# EAGLE design axiom_beta_plugin_module_1xUSB30 (EAGLE 7.7.0)
Assembly variants: Beta
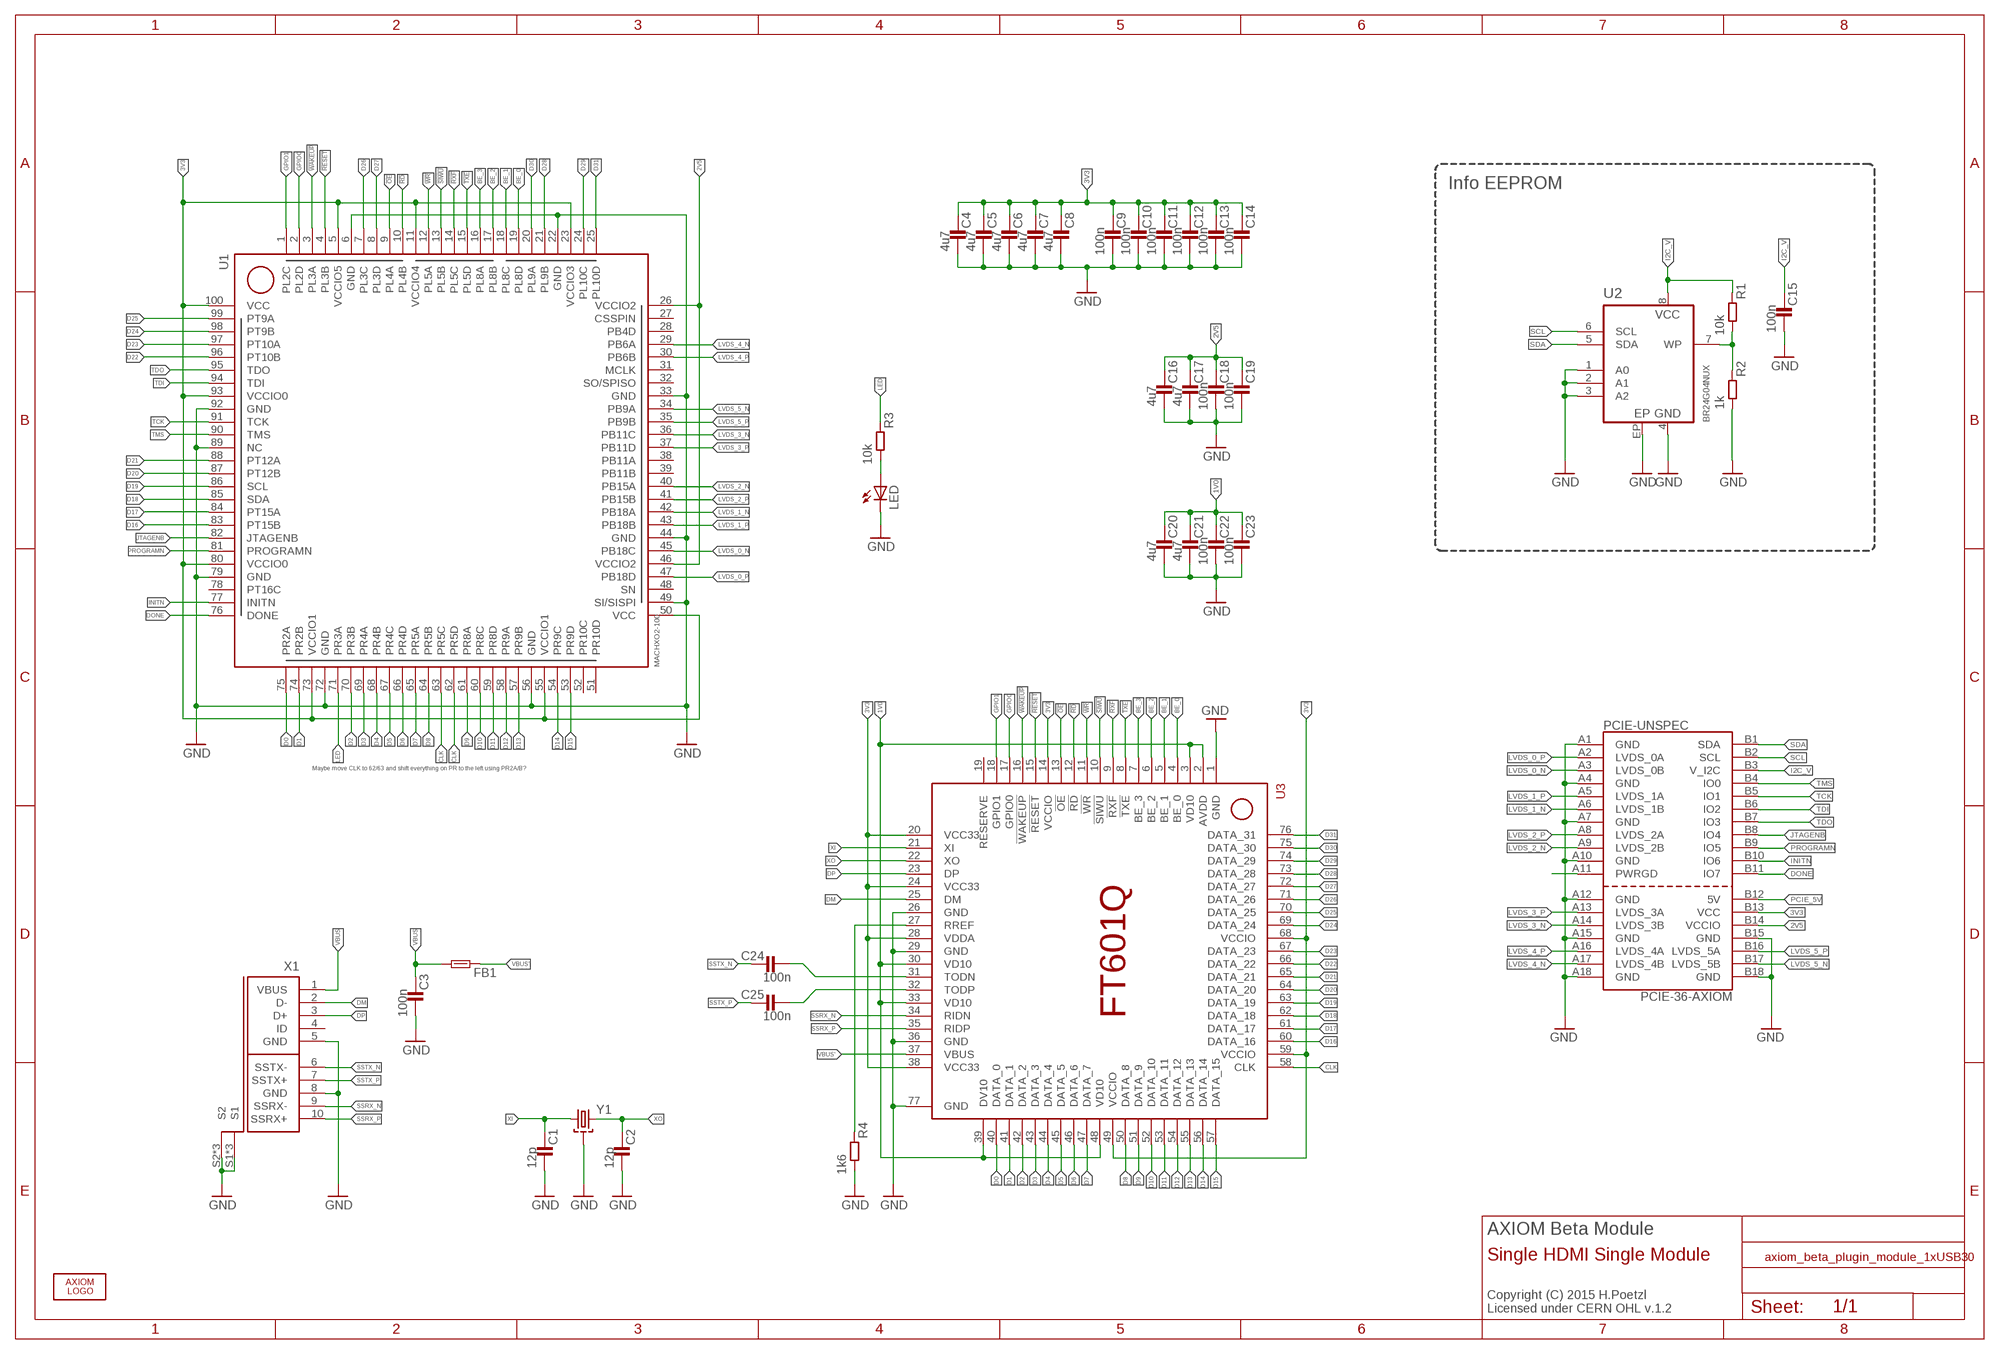
[diagram p0: schematic, sheet 1]

## Parts
C1  12p  C0402-C  [0402-C]
C2  12p  C0402-C  [0402-C]
C3  100n  C0402-C  [0402-C]
C4  4u7  C0402-C  [0402-C]
C5  4u7  C0402-C  [0402-C]
C6  4u7  C0402-C  [0402-C]
C7  4u7  C0402-C  [0402-C]
C8  4u7  C0402-C  [0402-C]
C9  100n  C0402-C  [0402-C]
C10  100n  C0402-C  [0402-C]
C11  100n  C0402-C  [0402-C]
C12  100n  C0402-C  [0402-C]
C13  100n  C0402-C  [0402-C]
C14  100n  C0402-C  [0402-C]
C15  100n  C0402-C  [0402-C]
C16  4u7  C0402-C  [0402-C]
C17  4u7  C0402-C  [0402-C]
C18  100n  C0402-C  [0402-C]
C19  100n  C0402-C  [0402-C]
C20  4u7  C0402-C  [0402-C]
C21  4u7  C0402-C  [0402-C]
C22  100n  C0402-C  [0402-C]
C23  100n  C0402-C  [0402-C]
C24  100n  C0201-C  [0201-C]
C25  100n  C0201-C  [0201-C]
FB1  FB0402-C  [0402-C]
LED  LED  [CHIPLED_0603]
PCIE-UNSPEC  PCIE-36-AXIOM  [PCIE-36-AXIOM]  (not fitted in variant Beta)
R1  10k  R0402-C  [0402-C]
R2  1k  R0402-C  [0402-C]
R3  10k  R0402-B  [0402-B]
R4  1k6  R0201-C  [0201-C]
U1  MACHXO2-100  [MACHXO2-100TQFP]
U2  BR24G04NUX  [DFN200X300X100-9N]
U3  FT601QQFN76  [QFN76]
U$  AXIOM_LOGO328X50  [AXIOM_LOGO_328X50]
X1  10_USB_3.0_2S-SMT  [MICRO-B-30-H-SMT]
Y1  SMD-4P-2G-2.0X1.6  [2.0X1.6]

## Nets
1V0 [power]: C20.1 C21.1 C22.1 C23.1 U3.2(AVDD) U3.3(VD10) U3.30(VD10) U3.33(VD10) U3.39(DV10) U3.48(VD10)
2V5 [power]: C16.1 C17.1 C18.1 C19.1 PCIE-UNSPEC.B14(VCCIO) U1.26(VCCIO2) U1.46(VCCIO2)
3V3 [power]: C4.1 C5.1 C6.1 C7.1 C8.1 C9.1 C10.1 C11.1 C12.1 C13.1 C14.1 PCIE-UNSPEC.B13(VCC) U1.5(VCCIO5) U1.11(VCCIO4) U1.23(VCCIO3) U1.50(VCC) U1.55(VCCIO1) U1.73(VCCIO1) U1.80(VCCIO0) U1.93(VCCIO0) U1.100(VCC) U3.14(VCCIO) U3.20(VCC33) U3.24(VCC33) U3.28(VDDA) U3.38(VCC33) U3.49(VCCIO) U3.59(VCCIO) U3.68(VCCIO)
!OE [parallel]: U1.9(PL4A) U3.13(!OE)
!RD [parallel]: U1.10(PL4B) U3.12(!RD)
!RESET: U1.4(PL3B) U3.15(!RESET)
!RXF [parallel]: U1.14(PL5C) U3.9(!RXF)
!SIWU [parallel]: U1.13(PL5B) U3.10(!SIWU)
!TXE [parallel]: U1.15(PL5D) U3.8(!TXE)
!WAKEUP: U1.3(PL3A) U3.16(!WAKEUP)
!WR [parallel]: U1.12(PL5A) U3.11(!WR)
BE_0 [parallel]: U1.19(PL8D) U3.4(BE_0)
BE_1 [parallel]: U1.18(PL8C) U3.5(BE_1)
BE_2 [parallel]: U1.17(PL8B) U3.6(BE_2)
BE_3 [parallel]: U1.16(PL8A) U3.7(BE_3)
CLK [parallel]: U1.62(PR5D) U1.63(PR5C) U3.58(CLK)
D0 [parallel]: U1.75(PR2A) U3.40(DATA_0)
D1 [parallel]: U1.74(PR2B) U3.41(DATA_1)
D2 [parallel]: U1.70(PR3B) U3.42(DATA_2)
D3 [parallel]: U1.69(PR4A) U3.43(DATA_3)
D4 [parallel]: U1.68(PR4B) U3.44(DATA_4)
D5 [parallel]: U1.67(PR4C) U3.45(DATA_5)
D6 [parallel]: U1.66(PR4D) U3.46(DATA_6)
D7 [parallel]: U1.65(PR5A) U3.47(DATA_7)
D8 [parallel]: U1.64(PR5B) U3.50(DATA_8)
D9 [parallel]: U1.61(PR8A) U3.51(DATA_9)
D10 [parallel]: U1.60(PR8C) U3.52(DATA_10)
D11 [parallel]: U1.59(PR8D) U3.53(DATA_11)
D12 [parallel]: U1.58(PR9A) U3.54(DATA_12)
D13 [parallel]: U1.57(PR9B) U3.55(DATA_13)
D14 [parallel]: U1.54(PR9C) U3.56(DATA_14)
D15 [parallel]: U1.53(PR9D) U3.57(DATA_15)
D16 [parallel]: U1.83(PT15B) U3.60(DATA_16)
D17 [parallel]: U1.84(PT15A) U3.61(DATA_17)
D18 [parallel]: U1.85(SDA) U3.62(DATA_18)
D19 [parallel]: U1.86(SCL) U3.63(DATA_19)
D20 [parallel]: U1.87(PT12B) U3.64(DATA_20)
D21 [parallel]: U1.88(PT12A) U3.65(DATA_21)
D22 [parallel]: U1.96(PT10B) U3.66(DATA_22)
D23 [parallel]: U1.97(PT10A) U3.67(DATA_23)
D24 [parallel]: U1.98(PT9B) U3.69(DATA_24)
D25 [parallel]: U1.99(PT9A) U3.70(DATA_25)
D26 [parallel]: U1.7(PL3C) U3.71(DATA_26)
D27 [parallel]: U1.8(PL3D) U3.72(DATA_27)
D28 [parallel]: U1.21(PL9B) U3.73(DATA_28)
D29 [parallel]: U1.24(PL10C) U3.74(DATA_29)
D30 [parallel]: U1.20(PL9A) U3.75(DATA_30)
D31 [parallel]: U1.25(PL10D) U3.76(DATA_31)
DM: U3.25(DM) X1.2(D-)
DONE: PCIE-UNSPEC.B11(IO7) U1.76(DONE)
DP: U3.23(DP) X1.3(D+)
GND: C1.2 C2.2 C3.2 C4.2 C5.2 C6.2 C7.2 C8.2 C9.2 C10.2 C11.2 C12.2 C13.2 C14.2 C15.2 C16.2 C17.2 C18.2 C19.2 C20.2 C21.2 C22.2 C23.2 LED.C PCIE-UNSPEC.A1(GND) PCIE-UNSPEC.A4(GND) PCIE-UNSPEC.A7(GND) PCIE-UNSPEC.A10(GND) PCIE-UNSPEC.A12(GND) PCIE-UNSPEC.A15(GND) PCIE-UNSPEC.A18(GND) PCIE-UNSPEC.B15(GND) PCIE-UNSPEC.B18(GND) R2.2 R4.2 U1.6(GND) U1.22(GND) U1.33(GND) U1.44(GND) U1.49(SI/SISPI) U1.56(GND) U1.72(GND) U1.79(GND) U1.89(NC) U1.92(GND) U2.1(A0) U2.2(A1) U2.3(A2) U2.4(GND) U2.EP U3.1(GND) U3.26(GND) U3.29(GND) U3.36(GND) U3.77(GND) X1.5(GND) X1.8(GND) X1.S1 X1.S2 X1.Z1(S1) X1.Z2(S1) X1.Z3(S2) X1.Z4(S2) Y1.2(GND) Y1.4(GND)
GPIO0: U1.2(PL2D) U3.17(GPIO0)
GPIO1: U1.1(PL2C) U3.18(GPIO1)
I2C_V: C15.1 PCIE-UNSPEC.B3(V_I2C) R1.1 U2.8(VCC)
INITN: PCIE-UNSPEC.B10(IO6) U1.77(INITN)
JTAGENB: PCIE-UNSPEC.B8(IO4) U1.82(JTAGENB)
LED: R3.1 U1.71(PR3A)
LVDS_0_N [LVDS]: PCIE-UNSPEC.A3(LVDS_0B) U1.45(PB18C)
LVDS_0_P [LVDS]: PCIE-UNSPEC.A2(LVDS_0A) U1.47(PB18D)
LVDS_1_N [LVDS]: PCIE-UNSPEC.A6(LVDS_1B) U1.42(PB18A)
LVDS_1_P [LVDS]: PCIE-UNSPEC.A5(LVDS_1A) U1.43(PB18B)
LVDS_2_N [LVDS]: PCIE-UNSPEC.A9(LVDS_2B) U1.40(PB15A)
LVDS_2_P [LVDS]: PCIE-UNSPEC.A8(LVDS_2A) U1.41(PB15B)
LVDS_3_N [LVDS]: PCIE-UNSPEC.A14(LVDS_3B) U1.36(PB11C)
LVDS_3_P [LVDS]: PCIE-UNSPEC.A13(LVDS_3A) U1.37(PB11D)
LVDS_4_N [LVDS]: PCIE-UNSPEC.A17(LVDS_4B) U1.29(PB6A)
LVDS_4_P [LVDS]: PCIE-UNSPEC.A16(LVDS_4A) U1.30(PB6B)
LVDS_5_N [LVDS]: PCIE-UNSPEC.B17(LVDS_5B) U1.34(PB9A)
LVDS_5_P [LVDS]: PCIE-UNSPEC.B16(LVDS_5A) U1.35(PB9B)
N$1: LED.A R3.2
N$2: R4.1 U3.27(RREF)
N$12: R1.2 R2.1 U2.7(WP)
N$209: PCIE-UNSPEC.A11(PWRGD)
PCIE_5V: PCIE-UNSPEC.B12(5V)
PROGRAMN: PCIE-UNSPEC.B9(IO5) U1.81(PROGRAMN)
SCL: PCIE-UNSPEC.B2(SCL) U2.6(SCL)
SDA: PCIE-UNSPEC.B1(SDA) U2.5(SDA)
SSRX_N [MGT]: U3.34(RIDN) X1.9(SSRX-)
SSRX_P [MGT]: U3.35(RIDP) X1.10(SSRX+)
SSTX_N [MGT]: C24.1 X1.6(SSTX-)
SSTX_P [MGT]: C25.1 X1.7(SSTX+)
TCK: PCIE-UNSPEC.B5(IO1) U1.91(TCK)
TDI: PCIE-UNSPEC.B6(IO2) U1.94(TDI)
TDO: PCIE-UNSPEC.B7(IO3) U1.95(TDO)
TMS: PCIE-UNSPEC.B4(IO0) U1.90(TMS)
TOD_N [MGT]: C24.2 U3.31(TODN)
TOD_P [MGT]: C25.2 U3.32(TODP)
VBUS [power]: C3.1 FB1.2 X1.1(VBUS)
VBUS' [power]: FB1.1 U3.37(VBUS)
XI: C1.1 U3.21(XI) Y1.1
XO: C2.1 U3.22(XO) Y1.3
Unconnected: U1.27(CSSPIN) U1.28(PB4D) U1.31(MCLK) U1.32(SO/SPISO) U1.38(PB11A) U1.39(PB11B) U1.48(SN) U1.51(PR10D) U1.52(PR10C) U1.78(PT16C) U3.19(RESERVE) X1.4(ID)

## Notes on the sheet
- Info EEPROM
- Maybe move CLK to 62/63 and shift everything on PR to the left using PR2A/B?
- AXIOM Beta Module
- Single HDMI Single Module
- Copyright (C) 2015 H.Poetzl
  Licensed under CERN OHL v.1.2

## Library data of the parts
C1-C25 = generic-rcl:C
FB1 = generic-rcl:FB
LED = led:LED
PCIE-UNSPEC = PCIe:PCIE-36-AXIOM
R1-R4 = generic-rcl:R
U1 = machxo2:MACHXO2-100: Lattice MachXO2 ultra low power, instant-on, non-volatile PLD.
U2 = eeprom:BR24G04
U3 = ft601q:FT601Q
U$ = logos_apertus_axiom:AXIOM_LOGO
X1 = usb:10_USB_3.0_2S
Y1 = xtal:SMD-4P-2G

## Net classes
0 default: width 0.127 mm, drill 0.203 mm, clearance 0.127 mm
1 power: width 0.203 mm, drill 0.254 mm, clearance 0.152 mm
2 LVDS: width 0.152 mm, drill 0.203 mm, clearance 0.152 mm
3 MGT: width 0.127 mm, drill 0.203 mm, clearance 0.127 mm
4 parallel: width 0.127 mm, drill 0.203 mm, clearance 0.127 mm

## Board
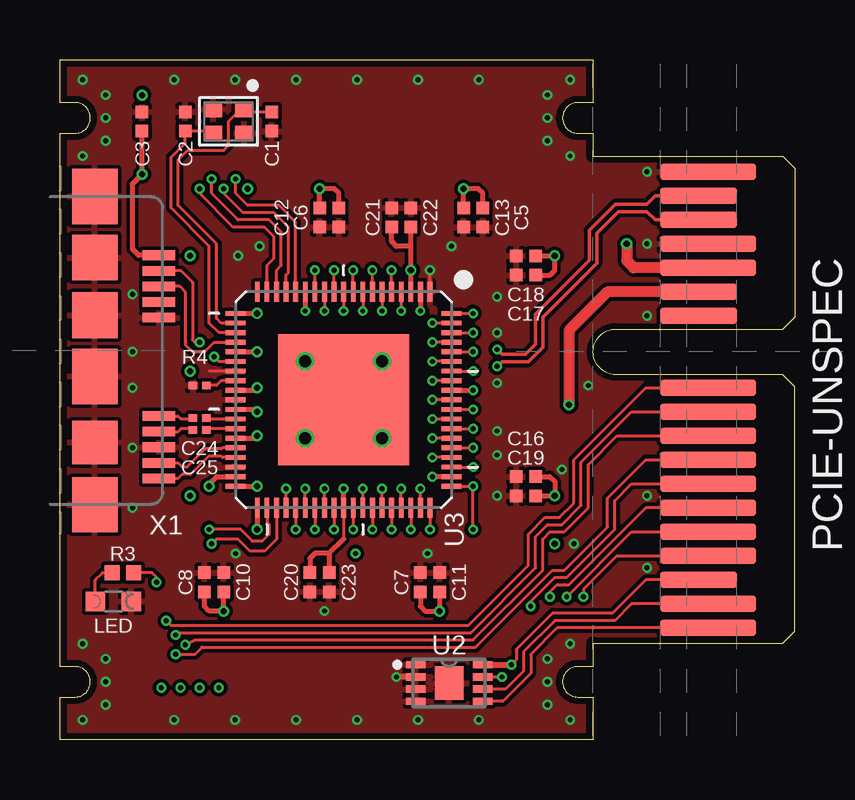
[diagram p1: board, top side]
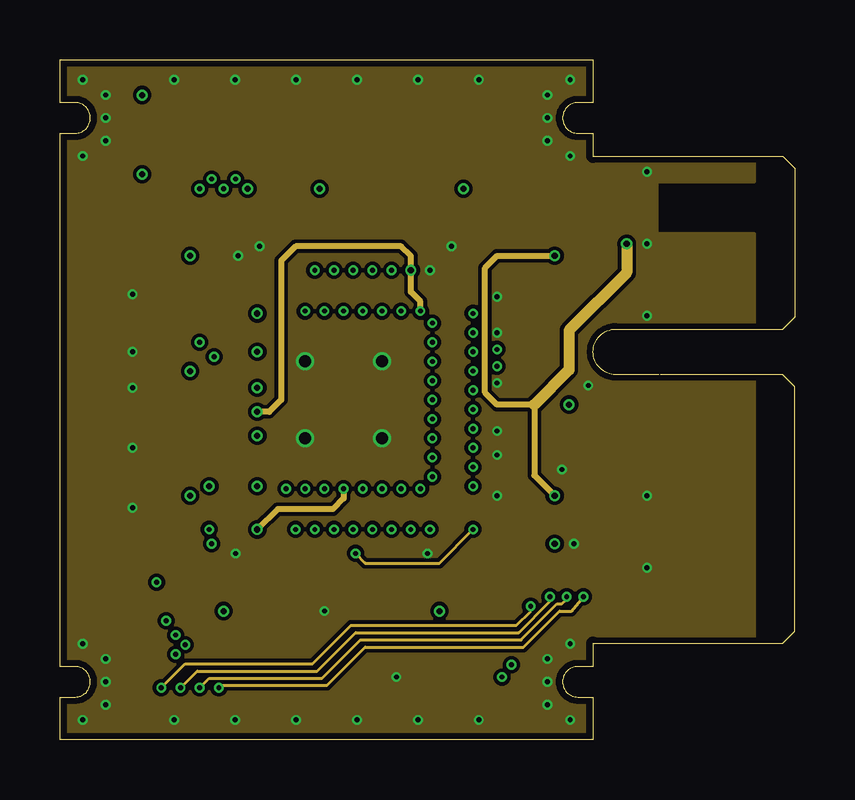
[diagram p2: board, inner layer Route2]
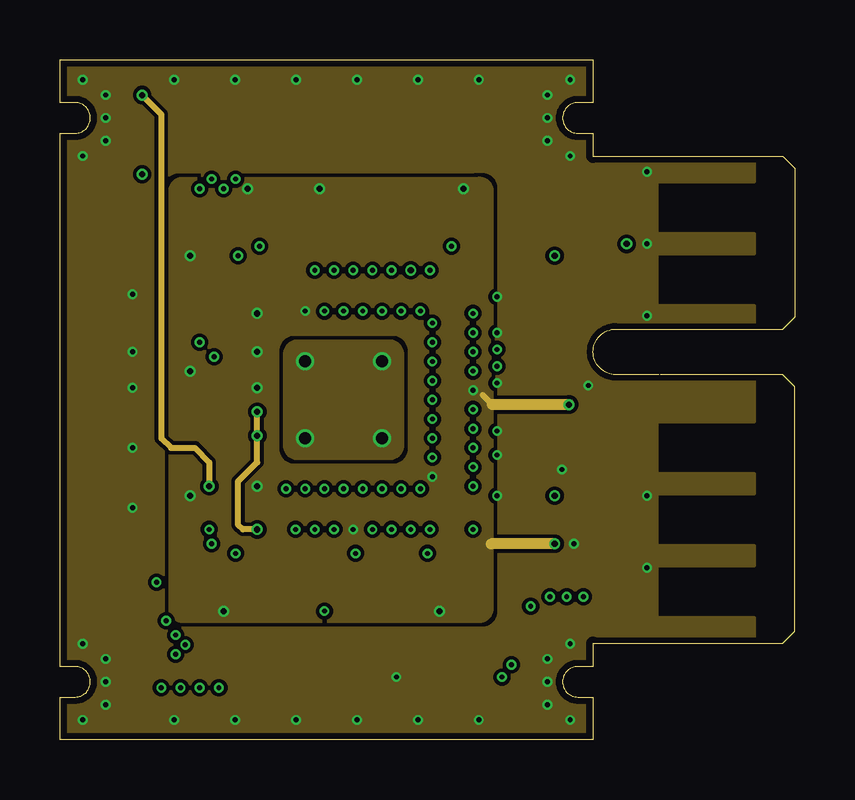
[diagram p3: board, inner layer Route15]
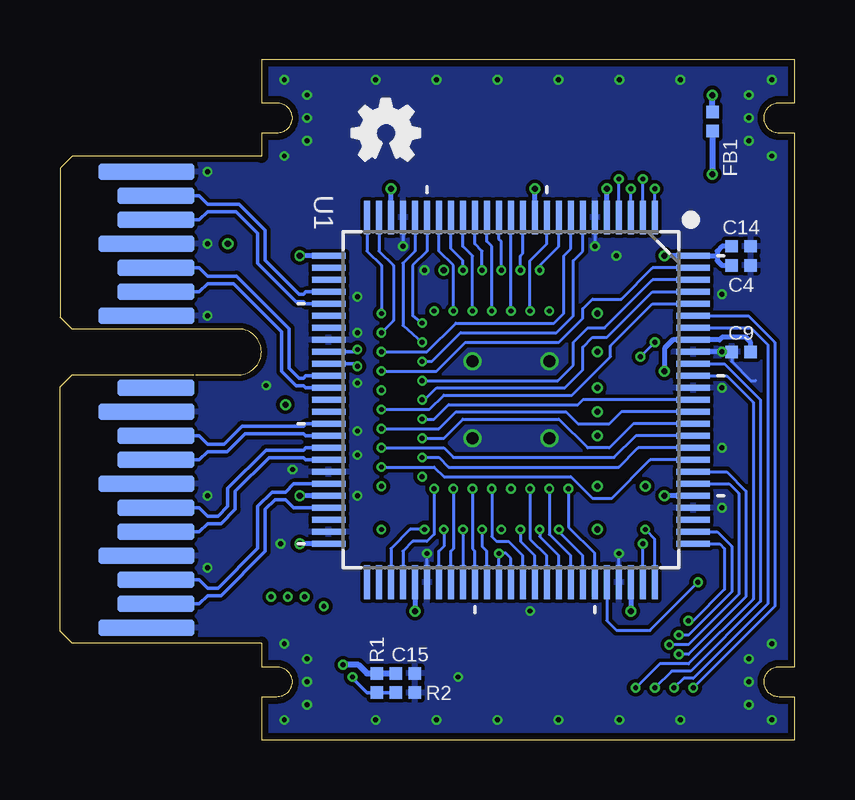
[diagram p4: board, bottom side, seen from below]

Size 30.62 x 28.32 mm. Coordinates in mm from the lower left corner, seen from the top.
Outline: 22.23,24.31 22.23,25.27 21.59,25.27 arc-90 20.96,25.91 arc-90 21.59,26.54 22.23,26.54 22.23,28.32 0,28.32 0,26.54 0.64,26.54 arc-90 1.27,25.91 arc-90 0.64,25.27 0,25.27 0,3.05 0.64,3.05 arc-90 1.27,2.41 arc-90 0.64,1.78 0,1.78 0,0 22.23,0 22.23,1.78 21.59,1.78 arc-90 20.96,2.41 arc-90 21.59,3.05 22.23,3.05 22.23,4.01
Copper layers (1*2*15*16): Top 0.035559375mm / dielectric 0.17018125mm / Route2 0.01778125mm / dielectric 47mil / Route15 0.01778125mm / dielectric 0.17018125mm / Bottom 0.035559375mm
Design rules "OSHPark-4layer-tuned *": minimum track width 5mil, minimum drill 8mil, track to track 6mil, track to pad 5mil, pad to pad 5mil, via to via 5mil, smd to smd 5mil, copper to edge 10mil, drill to drill 6mil, minimum pad ring 4mil, minimum via ring 4mil, stop-mask expansion 2mil, vias tented up to drill 20mil, thermal gap 6mil
tKeepout: area -1,24.3 to 2.2,27.5; area -1,0.8 to 2.2,4; area 20,0.8 to 23.2,4; area 20,24.3 to 23.2,27.5
bKeepout: area -1,24.3 to 2.2,27.5; area -1,0.8 to 2.2,4; area 20,0.8 to 23.2,4; area 20,24.3 to 23.2,27.5
tRestrict: area 7.4,18.2 to 7.8,18.6; area 7.4,9.8 to 7.8,10.2; area 15.8,9.8 to 16.2,10.2; area 15.8,18.2 to 16.2,18.6; area 7.8,15.2 to 8,15.6; area 7.8,14 to 8,14.4; area 7.8,11.2 to 8,11.6

### Footprints (pad centres in the part's own frame; a part is rotated, then mirrored left to right if it is on the bottom)
0402-C = smd 0.52 x 0.52: 1 -0.4,0; 2 0.4,0
0201-C = smd 0.36 x 0.32: 1 -0.28,0; 2 0.28,0
CHIPLED_0603 = smd 0.8 x 0.8: A 0,-0.75; C 0,0.75
PCIE-36-AXIOM = smd 0.7 x 4 bottom: A1 -11.5,3.6; A4 -8.5,3.6; A7 -5.5,3.6; A10 -2.5,3.6; A12 1.5,3.6; A15 4.5,3.6; A18 7.5,3.6 | smd 0.7 x 3.2 bottom: A2 -10.5,4; A3 -9.5,4; A5 -7.5,4; A6 -6.5,4; A8 -4.5,4; A9 -3.5,4; A11 -1.5,4; A13 2.5,4; A14 3.5,4; A16 5.5,4; A17 6.5,4 | smd 0.7 x 4: B1 -11.5,3.6; B2 -10.5,3.6; B4 -8.5,3.6; B5 -7.5,3.6; B6 -6.5,3.6; B7 -5.5,3.6; B8 -4.5,3.6; B9 -3.5,3.6; B10 -2.5,3.6; B11 -1.5,3.6; B14 3.5,3.6; B15 4.5,3.6; B18 7.5,3.6 | smd 0.7 x 3.2: B3 -9.5,4; B12 1.5,4; B13 2.5,4; B16 5.5,4; B17 6.5,4
0402-B = smd 0.62 x 0.62: 1 -0.45,0; 2 0.45,0
MACHXO2-100TQFP = smd 1.4 x 0.25: 1 -7.6,6; 2 -7.6,5.5; 3 -7.6,5; 4 -7.6,4.5; 5 -7.6,4; 6 -7.6,3.5; 7 -7.6,3; 8 -7.6,2.5; 9 -7.6,2; 10 -7.6,1.5; 11 -7.6,1; 12 -7.6,0.5; 13 -7.6,0; 14 -7.6,-0.5; 15 -7.6,-1; 16 -7.6,-1.5; 17 -7.6,-2; 18 -7.6,-2.5; 19 -7.6,-3; 20 -7.6,-3.5; 21 -7.6,-4; 22 -7.6,-4.5; 23 -7.6,-5; 24 -7.6,-5.5; 25 -7.6,-6; 51 7.6,-6; 52 7.6,-5.5; 53 7.6,-5; 54 7.6,-4.5; 55 7.6,-4; 56 7.6,-3.5; 57 7.6,-3; 58 7.6,-2.5; 59 7.6,-2; 60 7.6,-1.5; 61 7.6,-1; 62 7.6,-0.5; 63 7.6,0; 64 7.6,0.5; 65 7.6,1; 66 7.6,1.5; 67 7.6,2; 68 7.6,2.5; 69 7.6,3; 70 7.6,3.5; 71 7.6,4; 72 7.6,4.5; 73 7.6,5; 74 7.6,5.5; 75 7.6,6 | smd 0.25 x 1.4: 26 -6,-7.6; 27 -5.5,-7.6; 28 -5,-7.6; 29 -4.5,-7.6; 30 -4,-7.6; 31 -3.5,-7.6; 32 -3,-7.6; 33 -2.5,-7.6; 34 -2,-7.6; 35 -1.5,-7.6; 36 -1,-7.6; 37 -0.5,-7.6; 38 0,-7.6; 39 0.5,-7.6; 40 1,-7.6; 41 1.5,-7.6; 42 2,-7.6; 43 2.5,-7.6; 44 3,-7.6; 45 3.5,-7.6; 46 4,-7.6; 47 4.5,-7.6; 48 5,-7.6; 49 5.5,-7.6; 50 6,-7.6; 76 6,7.6; 77 5.5,7.6; 78 5,7.6; 79 4.5,7.6; 80 4,7.6; 81 3.5,7.6; 82 3,7.6; 83 2.5,7.6; 84 2,7.6; 85 1.5,7.6; 86 1,7.6; 87 0.5,7.6; 88 0,7.6; 89 -0.5,7.6; 90 -1,7.6; 91 -1.5,7.6; 92 -2,7.6; 93 -2.5,7.6; 94 -3,7.6; 95 -3.5,7.6; 96 -4,7.6; 97 -4.5,7.6; 98 -5,7.6; 99 -5.5,7.6; 100 -6,7.6
DFN200X300X100-9N = smd 0.813 x 0.305: 1 -1.397,0.762; 2 -1.397,0.254; 3 -1.397,-0.254; 4 -1.397,-0.762; 5 1.397,-0.762; 6 1.397,-0.254; 7 1.397,0.254; 8 1.397,0.762 | smd 1.194 x 1.397: EP 0,0
QFN76 = smd 0.84 x 0.2: 1 -4.5,3.6; 2 -4.5,3.2; 3 -4.5,2.8; 4 -4.5,2.4; 5 -4.5,2; 6 -4.5,1.6; 7 -4.5,1.2; 8 -4.5,0.8; 9 -4.5,0.4; 10 -4.5,0; 11 -4.5,-0.4; 12 -4.5,-0.8; 13 -4.5,-1.2; 14 -4.5,-1.6; 15 -4.5,-2; 16 -4.5,-2.4; 17 -4.5,-2.8; 18 -4.5,-3.2; 19 -4.5,-3.6; 39 4.5,-3.6; 40 4.5,-3.2; 41 4.5,-2.8; 42 4.5,-2.4; 43 4.5,-2; 44 4.5,-1.6; 45 4.5,-1.2; 46 4.5,-0.8; 47 4.5,-0.4; 48 4.5,0; 49 4.5,0.4; 50 4.5,0.8; 51 4.5,1.2; 52 4.5,1.6; 53 4.5,2; 54 4.5,2.4; 55 4.5,2.8; 56 4.5,3.2; 57 4.5,3.6 | smd 0.2 x 0.84: 20 -3.6,-4.5; 21 -3.2,-4.5; 22 -2.8,-4.5; 23 -2.4,-4.5; 24 -2,-4.5; 25 -1.6,-4.5; 26 -1.2,-4.5; 27 -0.8,-4.5; 28 -0.4,-4.5; 29 0,-4.5; 30 0.4,-4.5; 31 0.8,-4.5; 32 1.2,-4.5; 33 1.6,-4.5; 34 2,-4.5; 35 2.4,-4.5; 36 2.8,-4.5; 37 3.2,-4.5; 38 3.6,-4.5; 58 3.6,4.5; 59 3.2,4.5; 60 2.8,4.5; 61 2.4,4.5; 62 2,4.5; 63 1.6,4.5; 64 1.2,4.5; 65 0.8,4.5; 66 0.4,4.5; 67 0,4.5; 68 -0.4,4.5; 69 -0.8,4.5; 70 -1.2,4.5; 71 -1.6,4.5; 72 -2,4.5; 73 -2.4,4.5; 74 -2.8,4.5; 75 -3.2,4.5; 76 -3.6,4.5 | smd 5.45 x 5.45: 77 0,0
MICRO-B-30-H-SMT = smd 0.4 x 1.35: 1 -1.3,4.125; 2 -0.65,4.125; 3 0,4.125; 4 0.65,4.125; 5 1.3,4.125; 6 5.4,4.125; 7 6.05,4.125; 8 6.7,4.125; 9 7.35,4.125; 10 8,4.125 | smd 2.3 x 1.9: S1 -3.75,1.45; S2 9.1,1.45; Z3 3.75,1.45 | smd 1.9 x 1.9: Z1 -1.2,1.45; Z2 1.2,1.45 | smd 1.8 x 1.9: Z4 6.5,1.45
2.0X1.6 = smd 0.75 x 0.65: 1 -0.65,-0.5; 2 0.65,-0.5; 3 0.65,0.5; 4 -0.65,0.5

### Placement (x,y rotation side)
C1  8.83,25.76 270 top
C2  5.23,25.76 90 top
C3  3.43,25.76 90 top
C4  2.23,19.76 0 bottom
C5  17.62,21.76 270 top
C6  11.63,21.76 270 top
C7  15.03,6.56 90 top
C8  6.03,6.56 90 top
C9  2.23,16.16 180 bottom
C10  6.83,6.56 90 top
C11  15.83,6.56 90 top
C12  10.83,21.76 270 top
C13  16.83,21.76 270 top
C14  2.23,20.56 0 bottom
C15  16.23,2.76 0 bottom
C16  19.43,10.96 180 top
C17  19.43,19.36 180 top
C18  19.43,20.16 180 top
C19  19.43,10.16 180 top
C20  10.43,6.56 270 top
C21  13.83,21.76 90 top
C22  14.63,21.76 90 top
C23  11.23,6.56 270 top
C24  5.83,13.41 0 top
C25  5.83,12.91 0 top
FB1  3.43,25.76 270 bottom
LED  2.23,5.76 270 top
LOGO2  OSHW_LOGO_FILLX0100-NT  [OSHW_FILLX100_NOTEXT]  18.45,24.15 0 bottom
PCIE-UNSPEC  30.62,16.16 90 top
R1  17.43,2.36 270 bottom
R2  16.23,1.96 0 bottom
R3  2.62,6.96 180 top
R4  5.83,14.76 180 top
U1  11.83,14.16 270 bottom
U2  16.23,2.36 0 top
U3  11.83,14.16 270 top
U$  10.42,25.33 0 top
X1  0,18.89 270 top
Y1  7.03,25.76 180 top

### Tracks (layer width: path | path; a pad name or v marks a point on that pad's centre or on a via)
1V0  (via drill 0.2, 0.25)
  Top 0.127: U3.48 11.83,8.36
  Top 0.203: U3.2 v15.03,17.86 | U3.33 8.13,12.56 v8.23,12.66 | U3.30 8.13,13.76 v8.23,13.66 | U3.48 v11.83,10.46 | U3.39 v8.23,8.76 | 11.83,8.36 11.23,7.76 | U3.3 v14.63,19.56 14.63,20.56 | 11.23,7.76 10.63,7.76 10.43,7.56 C20.1 | 14.63,20.56 14.03,20.56 13.83,20.76 C21.1 | 11.23,7.76 C23.1 | 14.63,20.56 C22.1
  Route2 0.254: v15.03,17.86 15.03,18.26 U3.3 v14.63,19.56 14.63,20.16 14.23,20.56 9.83,20.56 9.23,19.96 9.23,14.16 8.73,13.66 v8.23,13.66 | v11.83,10.46 11.83,10.06 11.38,9.61 9.08,9.61 v8.23,8.76
  Route15 0.254: v8.23,13.66 v8.23,12.66 8.23,11.56 7.43,10.76 7.43,8.96 7.63,8.76 v8.23,8.76
2V5  (via drill 0.25, 0.26)
  Top 0.203: C19.1 v20.62,10.16 20.62,10.76 20.43,10.96 C16.1 | C18.1 v20.62,20.16 20.62,19.56 20.43,19.36 C17.1
  Top 0.457: PCIE-UNSPEC.B14 23.93,19.66 23.62,19.96 v23.62,20.66
  Route2 0.256: v20.62,20.16 18.23,20.16 17.73,19.66 17.73,14.46 18.23,13.96 19.78,13.96 19.78,11.01 v20.62,10.16
  Route2 0.457: v23.62,20.66 23.62,19.46 21.23,17.06 21.23,15.41 19.78,13.96
  Bottom 0.203: U1.26 v20.62,20.16 | U1.46 v20.62,10.16
3V3  (via drill 0.2, 0.25, 0.26)
  Top 0.127: U3.49 v12.23,8.76
  Top 0.203: C10.1 v6.83,5.36 6.23,5.36 6.03,5.56 C8.1 | C11.1 v15.83,5.36 15.23,5.36 15.03,5.56 C7.1 | C12.1 v10.83,22.96 11.43,22.96 11.63,22.76 C6.1 | C13.1 v16.83,22.96 17.43,22.96 17.62,22.76 C5.1 | U3.28 8.13,14.56 v8.23,14.66 | U3.38 v8.23,10.56 | U3.24 v8.23,16.16 | U3.20 v8.23,17.76 | U3.14 v10.23,17.86 | U3.59 v15.53,10.96 | U3.68 v17.23,14.56
  Top 0.457: PCIE-UNSPEC.B13 22.83,18.66 21.23,17.06 v21.23,13.96
  Route15 0.254: 18.03,13.96 17.62,14.36
  Route15 0.457: v21.23,13.96 18.03,13.96 | v20.62,8.16 17.98,8.16
  Bottom 0.203: U1.73 v6.83,5.36 | U1.55 v15.83,5.36 | U1.5 v7.83,22.96 | U1.11 v10.83,22.96 | U1.23 v16.83,22.96 | C9.1 1.83,16.56 2.03,16.76 3.03,16.76 3.12,16.66 U1.93 5.08,16.66 5.43,16.31 v5.43,15.36 | U1.80 v5.43,10.16 | U1.50 v20.62,8.16 | v5.43,20.16 U1.100 3.23,20.16 | C14.1 3.03,20.56 3.23,20.36 3.23,20.16 | 3.23,20.16 3.23,19.96 3.03,19.76 C4.1
  pour Route15 (rank 2): 4.62,5.47 4.62,22.85 arc-90 5.13,23.36 17.47,23.36 arc-90 17.98,22.85 17.98,5.47 arc-90 17.47,4.96 5.13,4.96 arc-90
!OE  (via drill 0.2)
  Top 0.127: U3.13 v10.63,19.56
  Bottom 0.127: v10.63,19.56 10.63,19.76 9.83,20.56 U1.9
!RD  (via drill 0.2)
  Top 0.127: U3.12 v11.03,17.86
  Bottom 0.127: v11.03,17.86 11.03,19.96 10.33,20.66 U1.10
!RESET  (via drill 0.2)
  Top 0.127: U3.15 9.83,21.56 9.13,22.26 7.83,22.26 7.33,22.76 v7.33,23.36
  Bottom 0.127: U1.4 v7.33,23.36
!RXF  (via drill 0.2)
  Top 0.127: U3.9 v12.23,19.56
  Bottom 0.127: v12.23,19.56 12.23,20.76 12.33,20.86 U1.14
!SIWU  (via drill 0.2)
  Top 0.127: U3.10 v11.83,17.86
  Bottom 0.127: v11.83,17.86 U1.13
!TXE  (via drill 0.2)
  Top 0.127: U3.8 v12.63,17.86
  Bottom 0.127: v12.63,17.86 12.63,20.56 12.83,20.76 U1.15
!WAKEUP  (via drill 0.2)
  Top 0.127: U3.16 9.43,19.36 9.53,19.46 9.53,21.36 8.93,21.96 7.63,21.96 6.83,22.76 v6.83,22.96
  Bottom 0.127: U1.3 v6.83,22.96
!WR  (via drill 0.2)
  Top 0.127: U3.11 v11.43,19.56
  Bottom 0.127: v11.43,19.56 11.43,20.16 11.33,20.26 U1.12
BE_0  (via drill 0.2)
  Top 0.127: U3.4 v14.23,17.86
  Bottom 0.127: v14.23,17.86 14.23,19.76 14.83,20.36 U1.19
BE_1  (via drill 0.2)
  Top 0.127: U3.5 v13.83,19.56
  Bottom 0.127: v13.83,19.56 13.83,19.96 14.33,20.46 U1.18
BE_2  (via drill 0.2)
  Top 0.127: U3.6 v13.43,17.86
  Bottom 0.127: v13.43,17.86 13.43,20.16 13.83,20.56 U1.17
BE_3  (via drill 0.2)
  Top 0.127: U3.7 v13.03,19.56
  Bottom 0.127: v13.03,19.56 13.03,20.36 13.33,20.66 U1.16
CLK  (via drill 0.2)
  Top 0.127: U3.58 v17.23,10.56 v17.23,8.76
  Route2 0.127: v12.33,7.76 12.73,7.36 15.83,7.36 v17.23,8.76
  Bottom 0.127: U1.63 11.83,7.56 12.03,7.76 v12.33,7.76 U1.62
D0  (via drill 0.2)
  Top 0.127: U3.40 8.63,9.06 8.73,8.96 8.73,8.56 8.43,8.26 8.03,8.26 7.53,8.76 v6.23,8.76
  Bottom 0.127: v6.23,8.76 5.83,8.36 U1.75
D1  (via drill 0.2)
  Top 0.127: U3.41 9.03,8.36 8.53,7.86 7.93,7.86 7.43,8.36 6.53,8.36 v6.33,8.16
  Bottom 0.127: U1.74 v6.33,8.16
D2  (via drill 0.2)
  Top 0.127: U3.42 v9.43,10.46
  Bottom 0.127: v9.43,10.46 9.43,8.86 8.33,7.76 U1.70
D3  (via drill 0.2)
  Top 0.127: U3.43 v9.83,8.76
  Bottom 0.127: v9.83,8.76 9.83,8.66 8.83,7.66 U1.69
D4  (via drill 0.2)
  Top 0.127: U3.44 v10.23,10.46
  Bottom 0.127: v10.23,10.46 10.23,8.56 9.33,7.66 U1.68
D5  (via drill 0.2)
  Top 0.127: U3.45 v10.63,8.76
  Bottom 0.127: v10.63,8.76 10.63,8.46 9.83,7.66 U1.67
D6  (via drill 0.2)
  Top 0.127: U3.46 v11.03,10.46
  Bottom 0.127: v11.03,10.46 11.03,8.36 10.33,7.66 U1.66
D7  (via drill 0.2)
  Top 0.127: U3.47 v11.43,8.76
  Bottom 0.127: v11.43,8.76 11.43,8.26 10.83,7.66 U1.65
D8  (via drill 0.2)
  Top 0.127: U3.50 v12.63,10.46
  Bottom 0.127: v12.63,10.46 12.63,8.46 12.43,8.26 11.93,8.26 11.33,7.66 U1.64
D9  (via drill 0.2)
  Top 0.127: U3.51 v13.03,8.76
  Bottom 0.127: v13.03,8.76 13.03,8.06 12.83,7.86 U1.61
D10  (via drill 0.2)
  Top 0.127: U3.52 v13.43,10.46
  Bottom 0.127: v13.43,10.46 13.43,7.96 13.33,7.86 U1.60
D11  (via drill 0.2)
  Top 0.127: U3.53 v13.83,8.76
  Bottom 0.127: v13.83,8.76 U1.59
D12  (via drill 0.2)
  Top 0.127: U3.54 v14.23,10.46
  Bottom 0.127: v14.23,10.46 14.23,7.96 14.33,7.86 U1.58
D13  (via drill 0.2)
  Top 0.127: U3.55 v14.63,8.76
  Bottom 0.127: v14.63,8.76 14.63,8.06 14.83,7.86 U1.57
D14  (via drill 0.2)
  Top 0.127: U3.56 v15.03,10.46
  Bottom 0.127: v15.03,10.46 15.03,8.56 15.33,8.26 15.93,8.26 16.33,7.86 U1.54
D15  (via drill 0.2)
  Top 0.127: U3.57 v15.43,8.76
  Bottom 0.127: v15.43,8.76 16.03,8.76 16.83,7.96 U1.53
D16  (via drill 0.2)
  Top 0.127: U3.60 v17.23,11.36
  Bottom 0.127: v17.23,11.36 15.03,11.36 14.63,10.96 9.33,10.96 8.43,10.06 7.63,10.06 6.03,11.66 U1.83
D17  (via drill 0.2)
  Top 0.127: U3.61 v15.53,11.76
  Bottom 0.127: v15.53,11.76 14.83,11.76 14.43,11.36 7.33,11.36 6.53,12.16 U1.84
D18  (via drill 0.2)
  Top 0.127: U3.62 v17.23,12.16
  Bottom 0.127: v17.23,12.16 14.63,12.16 14.23,11.76 7.53,11.76 6.63,12.66 U1.85
D19  (via drill 0.2)
  Top 0.127: U3.63 v15.53,12.56
  Bottom 0.127: v15.53,12.56 14.63,12.56 13.83,13.36 9.83,13.36 8.63,12.16 7.73,12.16 6.73,13.16 U1.86
D20  (via drill 0.2)
  Top 0.127: U3.64 v17.23,12.96
  Bottom 0.127: v17.23,12.96 14.83,12.96 14.13,13.66 9.53,13.66 9.03,13.16 7.73,13.16 7.23,13.66 U1.87
D21  (via drill 0.2)
  Top 0.127: U3.65 v15.53,13.36
  Bottom 0.127: v15.53,13.36 15.03,13.36 14.43,13.96 9.03,13.96 8.83,14.16 U1.88
D22  (via drill 0.2)
  Top 0.127: U3.66 v17.23,13.76
  Bottom 0.127: v17.23,13.76 15.23,13.76 14.63,14.36 9.28,14.36 7.68,15.96 7.68,16.41 5.93,18.16 U1.96
D23  (via drill 0.2)
  Top 0.127: U3.67 v15.53,14.16
  Bottom 0.127: v15.53,14.16 15.43,14.16 14.93,14.66 9.58,14.66 8.83,15.41 8.83,16.36 8.43,16.76 7.83,16.76 5.93,18.66 U1.97
D24  (via drill 0.2)
  Top 0.127: U3.69 v15.53,14.96
  Bottom 0.127: v15.53,14.96 9.88,14.96 9.23,15.61 9.23,16.56 8.63,17.16 7.93,17.16 5.93,19.16 U1.98
D25  (via drill 0.2)
  Top 0.127: U3.70 v17.23,15.36
  Bottom 0.127: v17.23,15.36 14.93,15.36 13.73,16.56 9.83,16.56 8.83,17.56 8.83,17.96 8.43,18.36 7.23,18.36 5.93,19.66 U1.99
D26  (via drill 0.2)
  Top 0.127: U3.71 v15.53,15.76
  Bottom 0.127: v15.53,15.76 15.13,15.76 13.93,16.96 9.93,16.96 9.23,17.66 9.23,19.96 8.83,20.36 U1.7
D27  (via drill 0.2)
  Top 0.127: U3.72 v17.23,16.16
  Bottom 0.127: v17.23,16.16 15.33,16.16 14.13,17.36 10.03,17.36 9.63,17.76 9.63,20.16 9.33,20.46 U1.8
D28  (via drill 0.2)
  Top 0.127: U3.73 v15.53,16.56
  Bottom 0.127: U1.21 15.83,20.36 16.33,19.86 16.33,17.26 v15.53,16.56
D29  (via drill 0.2)
  Top 0.127: U3.74 v17.23,16.96
  Bottom 0.127: U1.24 17.33,20.36 16.73,19.76 16.73,17.46 v17.23,16.96
D30  (via drill 0.2)
  Top 0.127: U3.75 v15.53,17.36
  Bottom 0.127: U1.20 15.33,20.36 15.93,19.76 15.93,17.66 v15.53,17.36
D31  (via drill 0.2)
  Top 0.127: U3.76 v17.23,17.76
  Bottom 0.127: U1.25 17.83,20.36 17.23,19.76 v17.23,17.76
DM  (via drill 0.2)
  Top 0.127: v5.83,16.56 5.62,16.56 5.53,16.66 5.53,19.06 5.05,19.54 X1.2 | v6.43,15.96 6.63,15.76 U3.25
  Bottom 0.127: v5.83,16.56 v6.43,15.96
DONE  (via drill 0.2)
  Top 0.127: v4.43,4.96 4.62,4.76 17.03,4.76 19.53,7.26 19.53,8.56 20.23,9.26 20.83,9.26 21.43,9.86 21.43,11.66 24.43,14.66 PCIE-UNSPEC.B11
  Bottom 0.127: v4.43,4.96 4.23,4.96 2.93,6.26 2.93,7.96 3.12,8.16 U1.76
DP
  Top 0.127: U3.23 6.43,16.56 6.03,16.16 5.53,16.16 5.23,16.46 5.23,18.66 5,18.89 X1.3
GND  (via drill 0.2, 0.5)
  Top 0.127: U3.1 v15.43,19.56 | v13.43,12.56 U3.77 | U3.26 6.23,15.36
  Top 0.254: U2.2 v14.03,2.61
  Bottom 0.127: U1.72 v7.33,7.76 | U1.56 v15.33,7.76 | U1.6 v8.33,20.56 | U1.22 v16.33,20.56 | C9.2 2.62,15.76 1.83,14.96 1.62,14.96
  Bottom 0.203: C9.2 v3.03,16.16 U1.92
  other vias: 0.95,27.5 21.27,27.5 21.27,0.83 0.95,0.83 4.76,27.5 17.46,27.5 4.76,0.83 0.95,4 0.95,24.32 1.91,24.96 21.27,24.32 17.46,0.83 21.27,4 7.3,27.5 9.84,27.5 12.38,27.5 1.91,26.86 20.32,24.96 20.32,26.86 1.91,1.46 1.91,3.37 20.32,3.37 20.32,1.46 9.84,0.83 12.38,0.83 7.3,0.83 14.92,0.83 20.32,25.91 1.91,25.91 1.91,2.41 20.32,2.41 24.48,10.16 24.48,7.16 24.48,23.66 24.48,20.66 14.92,27.5 10.23,15.76 13.43,15.76 10.23,12.56 3.03,14.66 18.23,16.96 18.23,14.86 18.23,12.86 18.23,11.86 18.23,18.46 18.23,10.16 22.03,14.76 24.48,17.66 11.03,5.36 7.43,20.16 3.03,9.66 3.03,18.56 3.03,12.16 21.43,8.16 20.93,11.26
  pour Bottom (isolate 0.127): 0,28.45 22.23,28.45 22.23,24.32 25.4,24.32 25.4,3.75 22.23,3.75 22.23,-0.13 0,-0.13
  pour Top (isolate 0.127): 0,28.45 22.23,28.45 22.23,24.32 25.4,24.32 25.4,3.75 22.23,3.75 22.23,-0.13 0,-0.13
  pour Route2 (isolate 0.127, rank 3): 0,28.45 22.23,28.45 22.23,24.57 28.96,24.57 28.96,23.24 24.89,23.24 24.89,21.08 28.96,21.08 28.96,3.75 22.23,3.75 22.23,-0.13 0,-0.13
  pour Route15 (isolate 0.127, rank 3): 0,28.45 22.23,28.45 22.23,24.57 28.96,24.57 28.96,23.24 24.89,23.24 24.89,21.08 28.96,21.08 28.96,20.24 24.89,20.24 24.89,18.08 28.96,18.08 28.96,13.24 24.89,13.24 24.89,11.08 28.96,11.08 28.96,10.24 24.89,10.24 24.89,8.08 28.96,8.08 28.96,7.24 24.89,7.24 24.89,5.08 28.96,5.08 28.96,3.75 22.23,3.75 22.23,-0.13 0,-0.13
  pour Route15: 13.72,11.76 9.93,11.76 arc-90 9.43,12.27 9.43,16.05 arc-90 9.93,16.56 13.72,16.56 arc-90 14.23,16.05 14.23,12.27 arc-90
GPIO0  (via drill 0.2)
  Top 0.127: U3.17 9.03,19.56 9.23,19.76 9.23,21.16 8.73,21.66 7.43,21.66 6.33,22.76 v6.33,23.36
  Bottom 0.127: U1.2 v6.33,23.36
GPIO1  (via drill 0.2)
  Top 0.127: U3.18 8.63,19.76 8.93,20.06 8.93,20.96 8.53,21.36 7.23,21.36 5.83,22.76 v5.83,22.96
  Bottom 0.127: U1.1 v5.83,22.96
I2C_V  (via drill 0.2)
  Top 0.127: PCIE-UNSPEC.B3 24.43,6.66 23.03,5.26 20.53,5.26 19.03,3.76 19.03,3.32 v18.83,3.12
  Top 0.254: U2.8 v18.83,3.12
  Bottom 0.254: v18.83,3.12 18.19,3.12 17.83,2.76 R1.1 C15.1
INITN  (via drill 0.2)
  Top 0.127: v4.83,4.36 4.93,4.46 17.12,4.46 19.83,7.16 19.83,8.46 20.33,8.96 20.93,8.96 21.73,9.76 21.73,11.56 23.83,13.66 PCIE-UNSPEC.B10
  Bottom 0.127: v4.83,4.36 4.43,4.36 2.62,6.16 2.62,8.06 3.23,8.66 U1.77
JTAGENB  (via drill 0.2)
  Top 0.127: v4.83,3.56 5.62,3.56 5.93,3.86 17.33,3.86 20.53,7.06 21.03,7.06 22.83,8.86 22.83,10.06 24.43,11.66 PCIE-UNSPEC.B8
  Bottom 0.127: U1.82 2.83,11.16 2.03,10.36 2.03,5.96 4.43,3.56 v4.83,3.56
LED  (via drill 0.2)
  Top 0.127: v4.03,6.56 4.03,6.76 3.83,6.96 R3.1
  Bottom 0.127: U1.71 7.83,4.96 7.43,4.56 6.03,4.56 v4.03,6.56
LVDS_0_N
  Bottom 0.152: U1.45 20.88,10.66 21.23,10.31 21.79,10.31 22.38,9.72 22.38,7.97 24.04,6.31 24.48,6.31 24.82,6.66 PCIE-UNSPEC.A3
LVDS_0_P
  Bottom 0.152: U1.47 20.88,9.66 21.23,10.01 21.66,10.01 22.07,9.6 22.07,7.85 23.91,6.01 24.48,6.01 24.82,5.66 PCIE-UNSPEC.A2
LVDS_1_N
  Bottom 0.152: U1.42 20.38,12.16 20.48,12.06 22.04,12.06 23.63,10.47 23.63,9.72 24.04,9.31 24.48,9.31 24.82,9.66 PCIE-UNSPEC.A6
LVDS_1_P
  Bottom 0.152: U1.43 20.38,11.66 20.48,11.76 21.91,11.76 23.32,10.35 23.32,9.6 23.91,9.01 24.48,9.01 24.82,8.66 PCIE-UNSPEC.A5
LVDS_2_N
  Bottom 0.152: U1.40 20.38,13.16 20.48,13.06 23.04,13.06 23.79,12.31 24.48,12.31 24.82,12.66 PCIE-UNSPEC.A9
LVDS_2_P
  Bottom 0.152: U1.41 20.38,12.66 20.48,12.76 22.91,12.76 23.66,12.01 24.48,12.01 24.82,11.66 PCIE-UNSPEC.A8
LVDS_3_N
  Bottom 0.152: PCIE-UNSPEC.A14 24.82,19.66 24.48,19.31 23.26,19.31 21.07,17.12 21.07,15.47 20.66,15.06 20.48,15.06 20.38,15.16 U1.36
LVDS_3_P
  Bottom 0.152: PCIE-UNSPEC.A13 24.82,18.66 24.48,19.01 23.39,19.01 21.38,17 21.38,15.35 20.79,14.76 20.48,14.76 20.38,14.66 U1.37
LVDS_4_N
  Bottom 0.152: PCIE-UNSPEC.A17 24.82,22.66 24.48,22.31 23.16,22.31 22.07,21.22 22.07,19.97 20.66,18.56 20.48,18.56 20.38,18.66 U1.29
LVDS_4_P
  Bottom 0.152: PCIE-UNSPEC.A16 24.82,21.66 24.48,22.01 23.29,22.01 22.38,21.1 22.38,19.85 20.79,18.26 20.48,18.26 20.38,18.16 U1.30
LVDS_5_N  (via drill 0.2)
  Top 0.152: PCIE-UNSPEC.B17 24.82,22.66 24.48,22.31 23.16,22.31 22.07,21.22 22.07,19.97 19.82,17.72 19.82,16.47 19.41,16.06 18.42,16.06 v18.23,16.26
  Bottom 0.152: U1.34 18.33,16.16 v18.23,16.26
LVDS_5_P  (via drill 0.2)
  Top 0.152: PCIE-UNSPEC.B16 24.82,21.66 24.48,22.01 23.29,22.01 22.38,21.1 22.38,19.85 20.13,17.6 20.13,16.35 19.54,15.76 18.42,15.76 v18.23,15.56
  Bottom 0.152: U1.35 18.33,15.66 v18.23,15.56
N$1
  Top 0.127: LED.A 1.48,6.66 1.78,6.96 R3.2
N$2
  Top 0.127: U3.27 6.73,14.96 6.53,14.76 R4.1
N$12  (via drill 0.2)
  Top 0.152: U2.7 v18.43,2.61
  Bottom 0.152: R2.1 R1.2 17.83,1.96 18.43,2.56 v18.43,2.61
PROGRAMN  (via drill 0.2)
  Top 0.127: v5.23,3.96 5.62,4.16 17.23,4.16 20.12,7.06 20.12,8.36 20.43,8.66 21.03,8.66 22.03,9.66 22.03,11.46 23.23,12.66 PCIE-UNSPEC.B9
  Bottom 0.127: U1.81 2.73,10.66 2.33,10.26 2.33,6.06 4.43,3.96 v5.23,3.96
SCL
  Top 0.127: PCIE-UNSPEC.B2 23.83,5.66 23.12,4.96 20.62,4.96 19.33,3.66 19.33,2.86 18.57,2.11 U2.6
SDA
  Top 0.127: PCIE-UNSPEC.B1 20.73,4.66 19.62,3.56 19.62,2.76 18.46,1.6 U2.5
  Top 0.152: 17.74,1.69 U2.5 17.74,1.69
SSRX_N
  Top 0.127: U3.34 6.77,12.16 6.73,12.11 6.06,12.11 5.31,11.36 5.1,11.36 4.93,11.54 X1.9
SSRX_P
  Top 0.127: U3.35 6.77,11.76 6.73,11.81 6.19,11.81 5.44,11.06 5.1,11.06 4.93,10.89 X1.10
SSTX_N
  Top 0.127: C24.1 5.5,13.36 5.05,13.36 4.93,13.49 X1.6
SSTX_P
  Top 0.127: C25.1 5.5,12.96 5.05,12.96 4.93,12.84 X1.7
TCK  (via drill 0.2)
  Top 0.127: v21.12,5.96 23.83,8.66 PCIE-UNSPEC.B5
  Route2 0.127: v5.83,2.16 6.23,2.56 10.93,2.56 12.53,4.16 19.23,4.16 20.73,5.66 20.93,5.66 21.12,5.86 v21.12,5.96
  Bottom 0.127: U1.91 2.93,15.66 1.43,14.16 1.43,5.76 4.33,2.86 5.12,2.86 v5.83,2.16
TDI  (via drill 0.2)
  Top 0.127: PCIE-UNSPEC.B6 24.43,9.66 21.23,6.46 21.03,6.46 20.73,6.46 20.43,6.16 v20.43,5.96
  Route2 0.127: v5.03,2.16 5.73,2.86 10.73,2.86 12.33,4.46 19.12,4.46 20.43,5.76 v20.43,5.96
  Bottom 0.127: U1.94 1.83,17.16 1.12,16.46 1.12,5.66 4.23,2.56 4.62,2.56 v5.03,2.16
TDO  (via drill 0.2)
  Top 0.127: v19.62,5.56 19.62,5.76 20.62,6.76 21.12,6.76 23.12,8.76 23.12,9.96 23.83,10.66 PCIE-UNSPEC.B7
  Route2 0.127: v4.23,2.16 5.23,3.16 10.53,3.16 12.13,4.76 19.03,4.76 19.62,5.36 v19.62,5.56
  Bottom 0.127: U1.95 1.93,17.66 0.83,16.56 0.83,5.56 v4.23,2.16
TMS  (via drill 0.2)
  Top 0.127: PCIE-UNSPEC.B4 23.23,7.66 21.83,6.26 v21.83,5.96
  Route2 0.127: v6.63,2.16 6.73,2.26 11.13,2.26 12.73,3.86 19.33,3.86 20.83,5.36 21.33,5.36 v21.83,5.96
  Bottom 0.127: U1.90 2.83,15.16 1.73,14.06 1.73,5.86 4.43,3.16 5.62,3.16 v6.63,2.16
TOD_N
  Top 0.127: U3.31 6.16,13.36 C24.2
TOD_P
  Top 0.127: U3.32 6.16,12.96 C25.2
VBUS  (via drill 0.25)
  Top 0.203: X1.1 3.28,20.19 3.03,20.44 3.03,23.16 v3.43,23.56 FB1.2
  Bottom 0.254: FB1.2 v3.43,23.56
VBUS'  (via drill 0.25)
  Top 0.203: v6.23,10.56 6.23,10.66 6.53,10.96 U3.37
  Route15 0.254: v3.43,26.86 4.23,26.06 4.23,12.56 4.62,12.16 5.62,12.16 6.23,11.56 v6.23,10.56
  Bottom 0.254: FB1.1 v3.43,26.86
XI
  Top 0.127: U3.21 6.73,17.36 6.53,17.56 6.53,20.66 4.93,22.26 4.93,24.16 5.33,24.56 6.83,24.56 7.03,24.76 7.03,25.76 7.53,26.26 Y1.1 7.78,26.16 C1.1
XO
  Top 0.127: U3.22 6.63,16.96 6.23,17.36 6.23,20.56 4.62,22.16 4.62,24.26 5.23,24.86 C2.1 6.28,25.36 Y1.3

### Text on the board
Measures: X1
tDocu: HIGH SPEED IO
_tSilk: 1x USB Module | V0.2 / R1.1
_bSilk: (C) 2017 H.Pötzl / Licensed under / CERN OHL v.1.2
tEngrave: AXIOM BETA SPM 1xUSB / TOP SIDE V0.2 R1.0
bEngrave: AXIOM BETA SPM 1xUSB / BOTTOM SIDE V0.2 R1.0